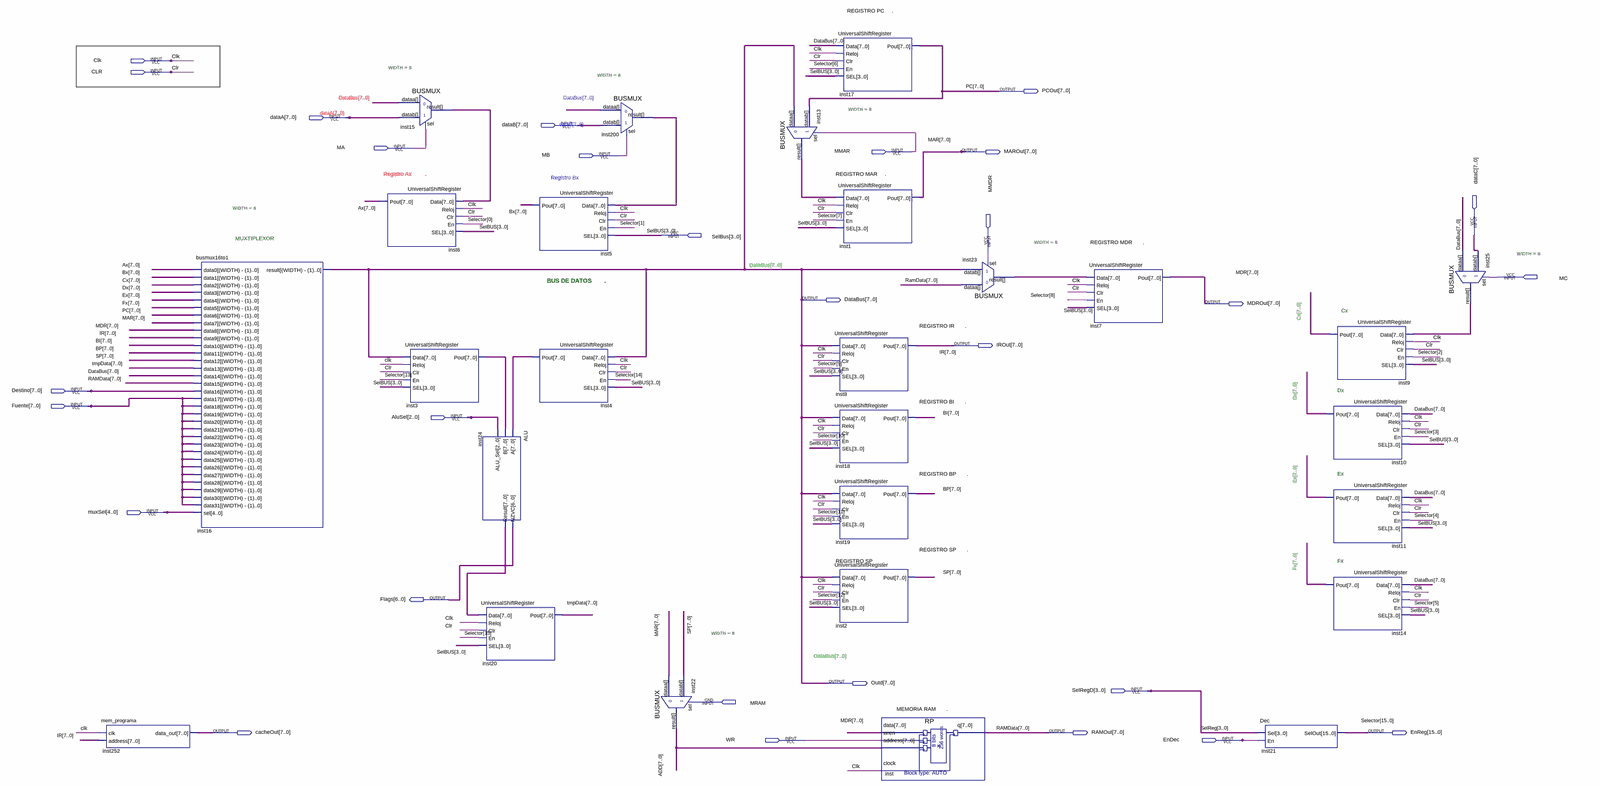
[diagram p0: schematic sheet, whole]
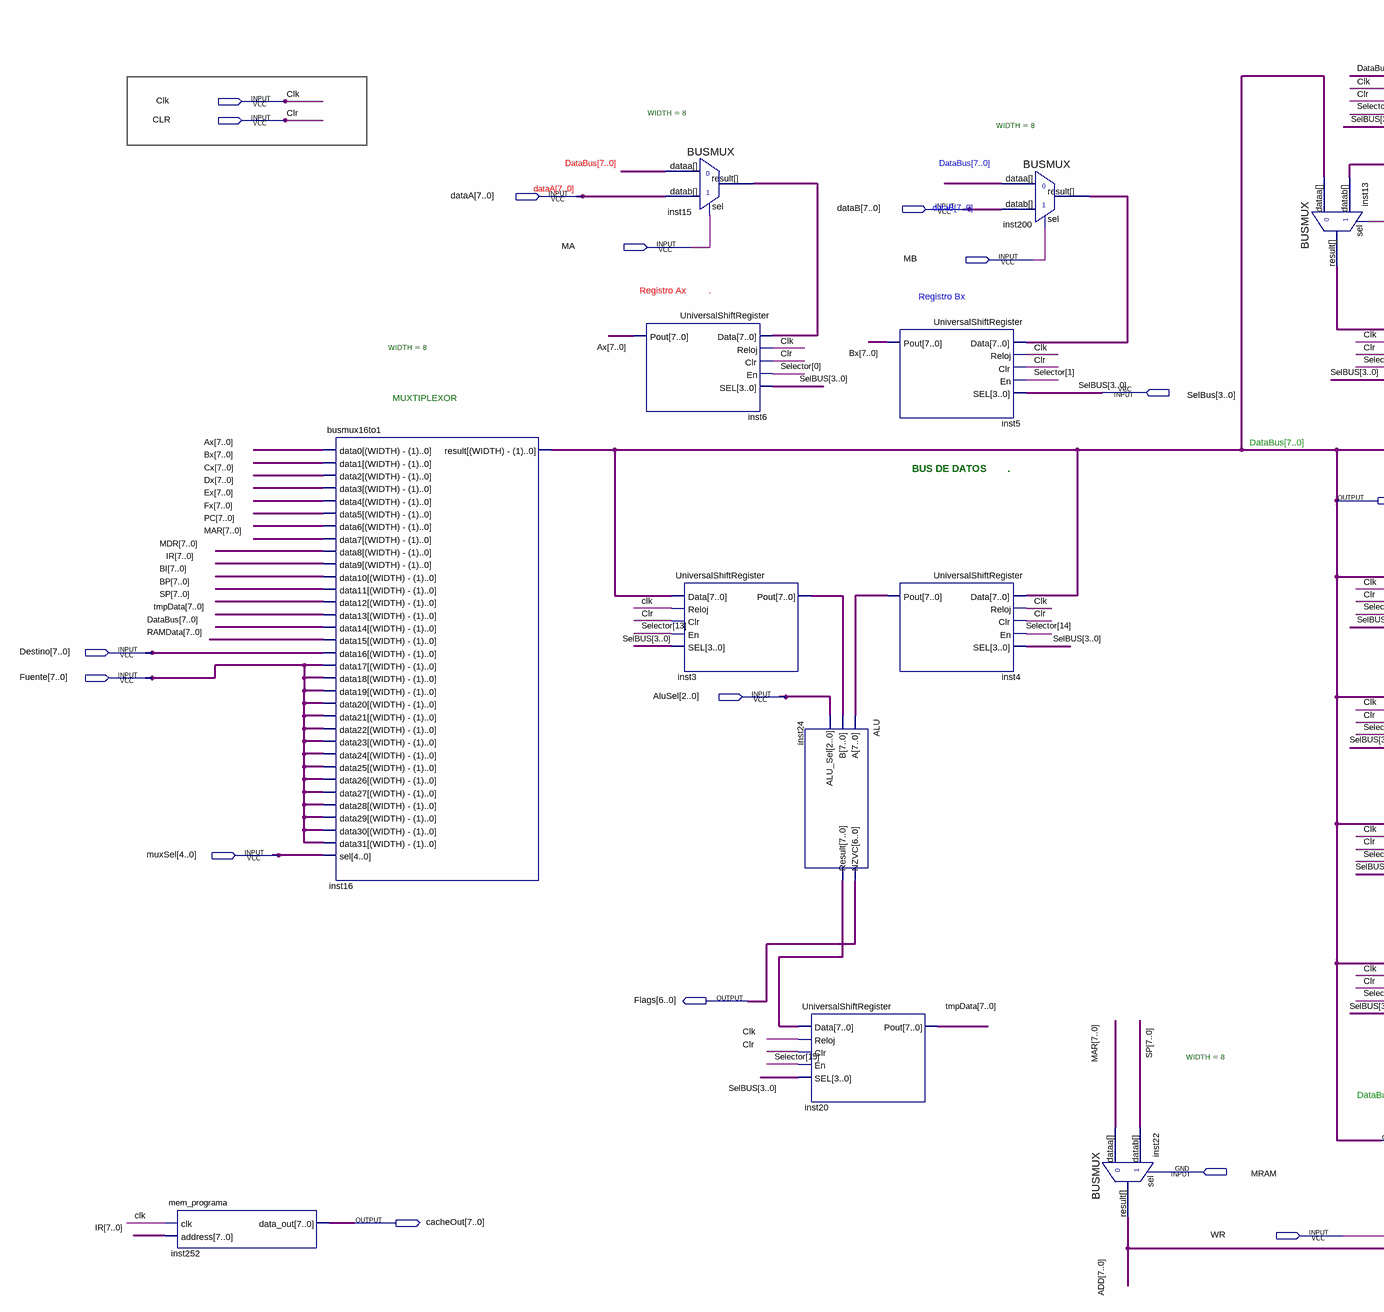
[diagram p1: schematic sheet, left part]
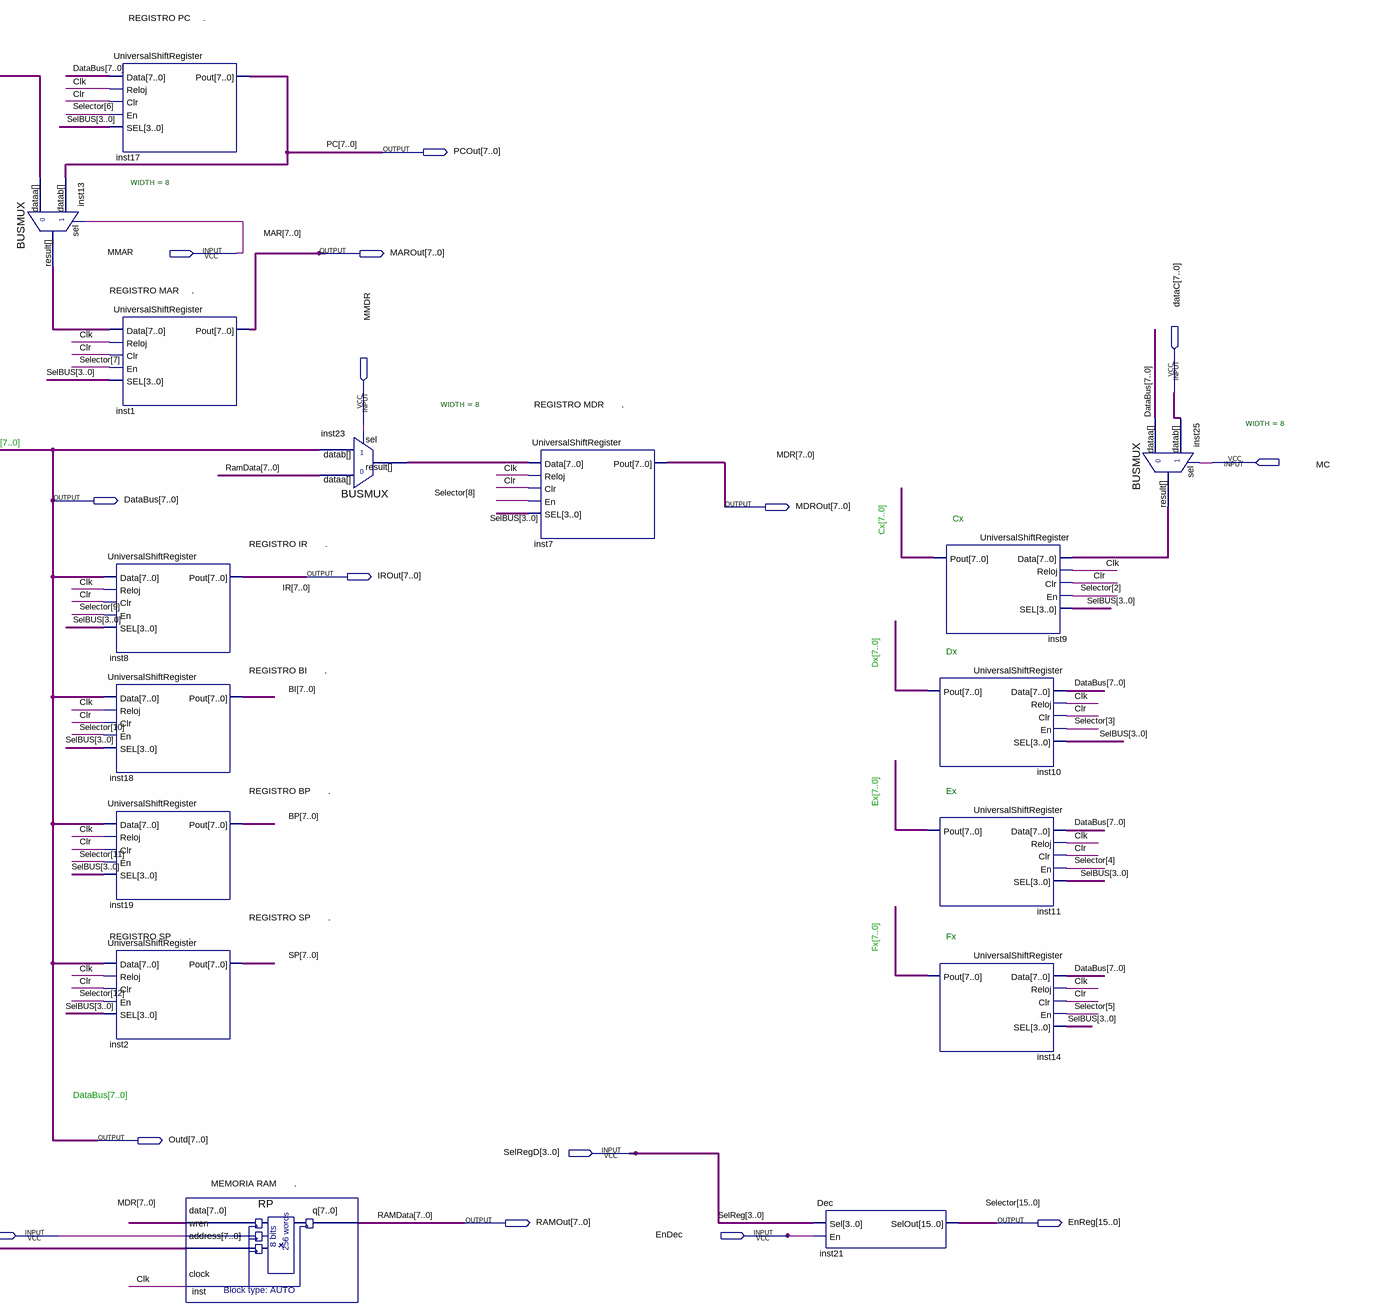
[diagram p2: schematic sheet, right part]
// Quartus schematic ElMicro.bdf as structural Verilog: 27 symbols, 29 pins
module ElMicro (
  input  Clk,
  input  CLR,
  input  [7:0] dataA,
  input  [7:0] dataB,
  input  MA,
  input  MMAR,
  input  MB,
  input  [3:0] SelBus,
  input  [7:0] dataC,
  input  MMDR,
  input  MC,
  input  [7:0] Destino,
  input  [7:0] Fuente,
  input  [2:0] AluSel,
  input  [4:0] muxSel,
  input  [3:0] SelRegD,
  input  MRAM,
  input  WR,
  input  EnDec,
  output [7:0] PCOut,
  output [7:0] MAROut,
  output [7:0] DataBus,
  output [7:0] MDROut,
  output [7:0] IROut,
  output [6:0] Flags,
  output [7:0] Outd,
  output [7:0] cacheOut,
  output [7:0] RAMOut,
  output [15:0] EnReg
);

  wire [7:0] ADD, Ax, BI, BP, Bx, Cx, Dx, Ex, Fx, inst3_pout, inst4_pout, inst13_result, inst15_result,
       inst23_result, inst24_result, inst25_result, inst200_result, SP, tmpData;

  mem_programa inst252 (.clk(Clk), .address(IROut), .data_out(cacheOut));
  busmux16to1 #(.WIDTH(8)) inst16 (
    .data0(Ax), .data1(Bx), .data2(Cx), .data3(Dx), .data4(Ex), .data5(Fx), .data6(PCOut), .data7(MAROut),
    .data8(MDROut), .data9(IROut), .data10(BI), .data11(BP), .data12(SP), .data13(tmpData), .data14(DataBus),
    .data15(RAMOut), .data16(Destino), .data17(Fuente), .data18(Fuente), .data19(Fuente), .data20(Fuente),
    .data21(Fuente), .data22(Fuente), .data23(Fuente), .data24(Fuente), .data25(Fuente), .data26(Fuente),
    .data27(Fuente), .data28(Fuente), .data29(Fuente), .data30(Fuente), .data31(Fuente), .sel(muxSel),
    .result(DataBus));
  BUSMUX #(.WIDTH(8)) inst15 (.datab(dataA), .sel(MA), .dataa(DataBus), .result(inst15_result));
  UniversalShiftRegister inst6 (.Data(inst15_result), .Reloj(Clk), .Clr(CLR), .En(EnReg[0]), .SEL(SelBus), .Pout(Ax));
  UniversalShiftRegister inst3 (
    .Data(DataBus), .Reloj(Clk), .Clr(CLR), .En(EnReg[13]), .SEL(SelBus), .Pout(inst3_pout));
  ALU inst24 (.A(inst4_pout), .B(inst3_pout), .ALU_Sel(AluSel), .NZVC(Flags), .Result(inst24_result));
  UniversalShiftRegister inst20 (
    .Data(inst24_result), .Reloj(Clk), .Clr(CLR), .En(EnReg[15]), .SEL(SelBus), .Pout(tmpData));
  UniversalShiftRegister inst5 (.Data(inst200_result), .Reloj(Clk), .Clr(CLR), .En(EnReg[1]), .SEL(SelBus), .Pout(Bx));
  UniversalShiftRegister inst4 (
    .Data(DataBus), .Reloj(Clk), .Clr(CLR), .En(EnReg[14]), .SEL(SelBus), .Pout(inst4_pout));
  BUSMUX #(.WIDTH(8)) inst200 (.datab(dataB), .sel(MB), .dataa(DataBus), .result(inst200_result));
  BUSMUX #(.WIDTH(8)) inst22 (.datab(SP), .sel(MRAM), .dataa(MAROut), .result(ADD));
  BUSMUX #(.WIDTH(8)) inst13 (.datab(PCOut), .sel(MMAR), .dataa(DataBus), .result(inst13_result));
  UniversalShiftRegister inst17 (.Data(DataBus), .Reloj(Clk), .Clr(CLR), .En(EnReg[6]), .SEL(SelBus), .Pout(PCOut));
  UniversalShiftRegister inst1 (
    .Data(inst13_result), .Reloj(Clk), .Clr(CLR), .En(EnReg[7]), .SEL(SelBus), .Pout(MAROut));
  UniversalShiftRegister inst8 (.Data(DataBus), .Reloj(Clk), .Clr(CLR), .En(EnReg[9]), .SEL(SelBus), .Pout(IROut));
  UniversalShiftRegister inst18 (.Data(DataBus), .Reloj(Clk), .Clr(CLR), .En(EnReg[10]), .SEL(SelBus), .Pout(BI));
  UniversalShiftRegister inst19 (.Data(DataBus), .Reloj(Clk), .Clr(CLR), .En(EnReg[11]), .SEL(SelBus), .Pout(BP));
  UniversalShiftRegister inst2 (.Data(DataBus), .Reloj(Clk), .Clr(CLR), .En(EnReg[12]), .SEL(SelBus), .Pout(SP));
  RP inst (.data(MDROut), .wren(WR), .address(ADD), .clock(Clk), .q(RAMOut));
  BUSMUX #(.WIDTH(8)) inst23 (.datab(DataBus), .sel(MMDR), .dataa(RAMOut), .result(inst23_result));
  UniversalShiftRegister inst7 (
    .Data(inst23_result), .Reloj(Clk), .Clr(CLR), .En(EnReg[8]), .SEL(SelBus), .Pout(MDROut));
  Dec inst21 (.Sel(SelRegD), .En(EnDec), .SelOut(EnReg));
  UniversalShiftRegister inst9 (.Data(inst25_result), .Reloj(Clk), .Clr(CLR), .En(EnReg[2]), .SEL(SelBus), .Pout(Cx));
  UniversalShiftRegister inst10 (.Data(DataBus), .Reloj(Clk), .Clr(CLR), .En(EnReg[3]), .SEL(SelBus), .Pout(Dx));
  UniversalShiftRegister inst11 (.Data(DataBus), .Reloj(Clk), .Clr(CLR), .En(EnReg[4]), .SEL(SelBus), .Pout(Ex));
  UniversalShiftRegister inst14 (.Data(DataBus), .Reloj(Clk), .Clr(CLR), .En(EnReg[5]), .SEL(SelBus), .Pout(Fx));
  BUSMUX #(.WIDTH(8)) inst25 (.datab(dataC), .sel(MC), .dataa(DataBus), .result(inst25_result));

  assign Outd = DataBus;

  // Other names for the same wires on the sheet: IR[7:0] = IROut; MAR[7:0] = MAROut; MDR[7:0] = MDROut;
  //   PC[7:0] = PCOut; RamData[7:0] = RAMOut; Selector[15:0] = EnReg; SelReg[3:0] = SelRegD

  // Notes on the sheet:
  //   REGISTRO PC     .
  //   Registro Ax         .
  //   REGISTRO MAR     .
  //   Registro Bx     
  //   MUXTIPLEXOR
  //   REGISTRO MDR       .
  //   BUS DE DATOS       . 
  //   Cx
  //   REGISTRO IR       .
  //   Dx
  //   REGISTRO BI       .
  //   REGISTRO BP       .
  //   Ex
  //   REGISTRO SP       .
  //   REGISTRO SP       .
  //   Fx
  //   MEMORIA RAM       .
endmodule
